# EAGLE board CosmicPiuTelescopeAlpha (EAGLE 8.3.1), part 1 of 2
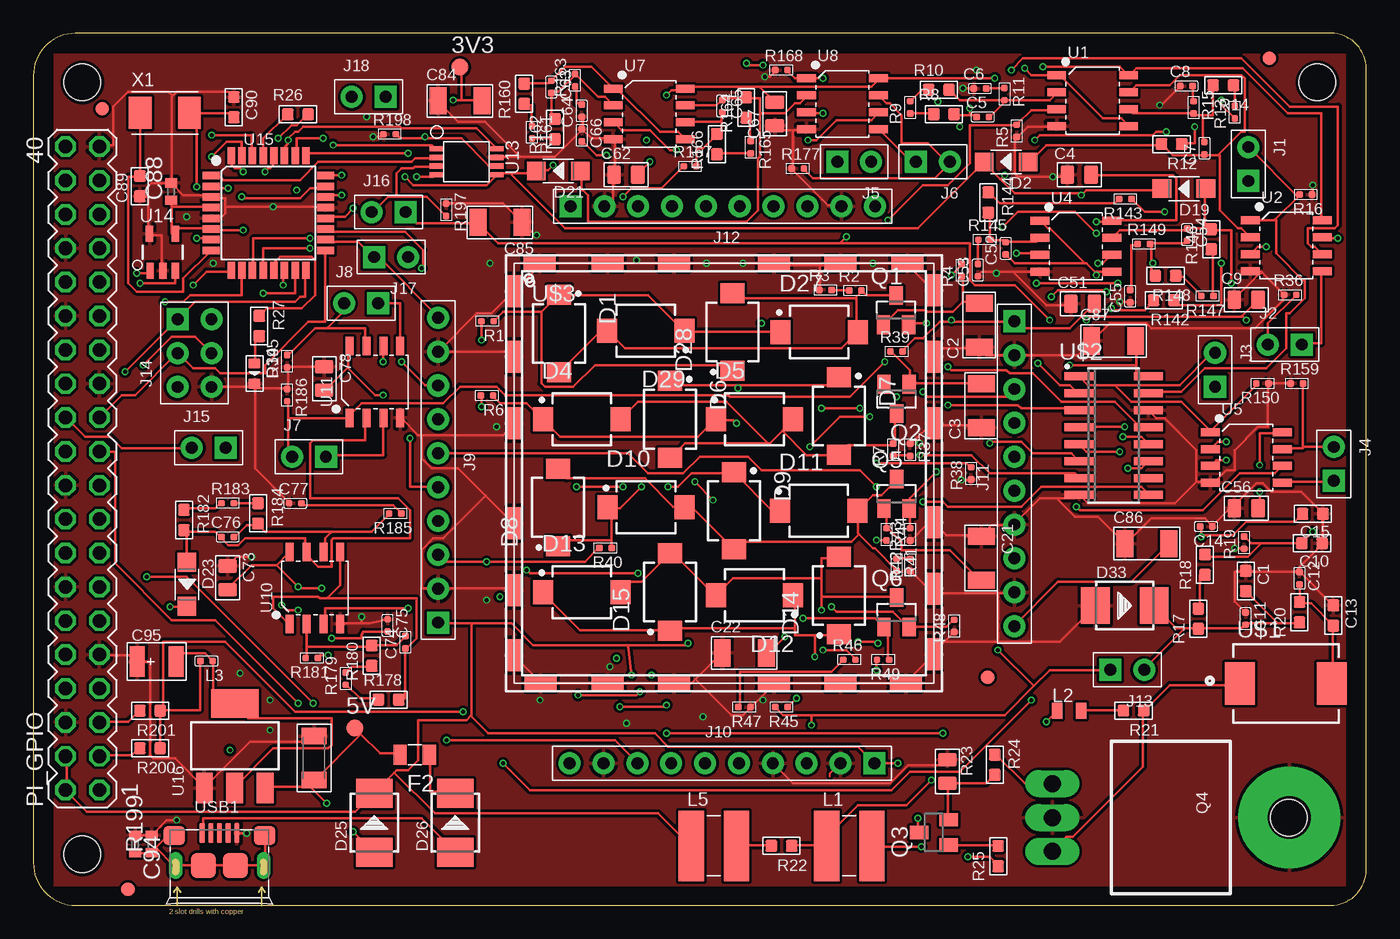
[diagram p2: board, top side]
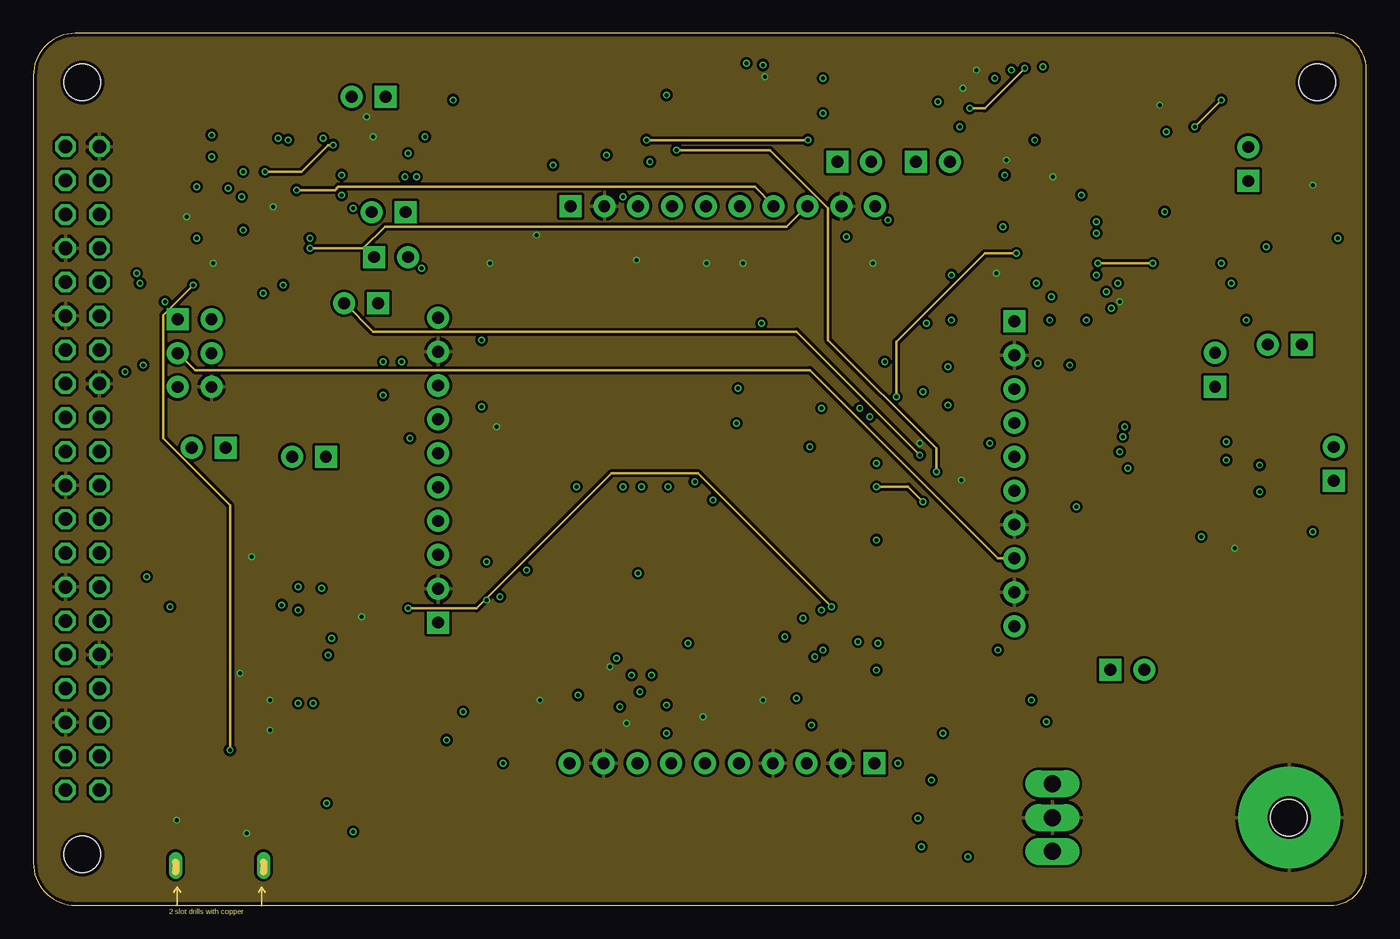
[diagram p3: board, inner layer Route2]
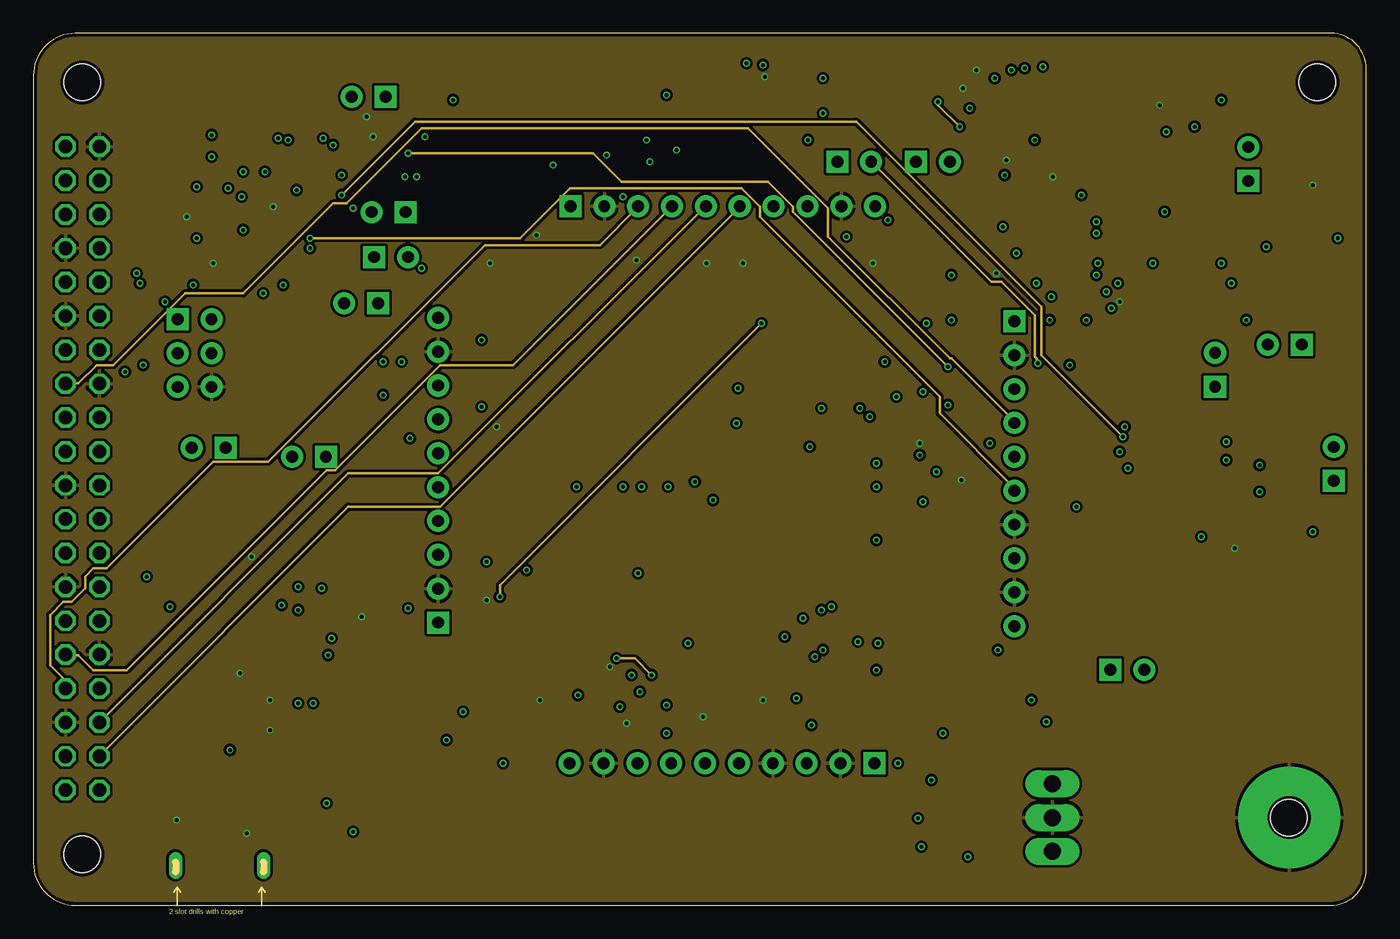
[diagram p4: board, inner layer Route15]
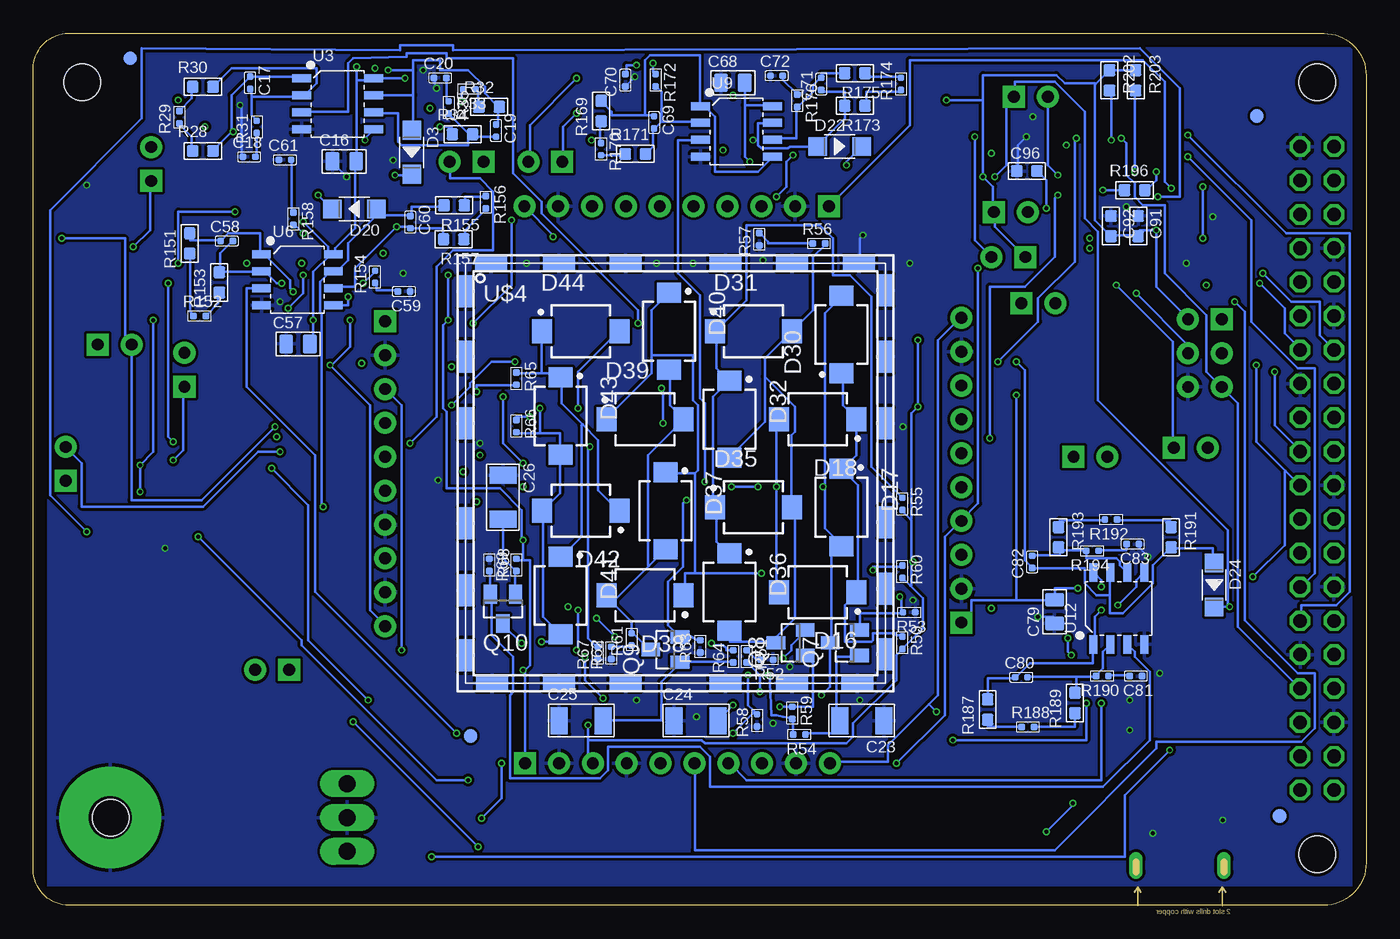
[diagram p5: board, bottom side, seen from below]

Size 100 x 65.39 mm. Coordinates in mm from the lower left corner, seen from the top.
Outline: 3.17,0 97.33,0 arc90 100,2.67 100,62.75 arc90 97.35,65.39 3.15,65.39 arc90 0,62.24 0,3.18 arc90 3.17,0
Copper layers (1*2*15*16): Top 0.035mm / dielectric 0.2mm / Route2 0.0175mm / dielectric 0.3mm / Route15 0.0175mm / dielectric 0.2mm / Bottom 0.035mm
Design rules "SeeedStudio_4layer_DRU_no_angle_20140221": minimum track width 8mil, minimum drill 12mil, track to track 8mil, track to pad 8mil, pad to pad 8mil, via to via 8mil, smd to smd 0mil, copper to edge 10mil, drill to drill 8mil, minimum pad ring 6mil, minimum via ring 4mil, stop-mask expansion 4mil, vias tented up to drill 25mil, thermal gap 10mil
Net classes: 0 default: width 0.152 mm, clearance 0.152 mm; 1 Power: width 0.152 mm, clearance 0.152 mm; 2 hv: width 0.152 mm, clearance 0.152 mm; 3 PowerGND: width 0.152 mm, clearance 0.152 mm
Holes 2.75 mm at 3.68,61.72 3.68,3.81 94.21,6.55 96.34,61.72
tRestrict: area 0,63.9 to 100.5,66.9; area 98.5,-1.1 to 101.5,65.4; area -3,-2.1 to 99.5,1.4; area -4,-2.1 to 1.5,66.4
bRestrict: area -0.5,64.4 to 100.5,67.4; area 99,-1.6 to 103,66.4; area -2,-2.6 to 102.5,1.4; area -2.5,0.4 to 1,66.4

## Footprints (pad centres in the part's own frame; a part is rotated, then mirrored left to right if it is on the bottom)
B1,27 = smd 1.27 x 1.27: TP 0,0
C0603 = smd 0.889 x 0.889: 1 0,0.762; 2 0,-0.762
C1206 = smd 1.27 x 2.032: 1 -1.651,0; 2 1.651,0
C0805 = smd 1.397 x 1.016: 1 0,0.889; 2 0,-0.889
C0402 = smd 0.5 x 0.5: 1 0,0.463; 2 0,-0.463
C0402' = smd 0.7 x 0.9: 1 -0.65,0; 2 0.65,0
1206 = smd 1.219 x 1.88: 1 -1.651,0; 2 1.651,0
AVX-B = smd 1.143 x 2.286: + -1.46,0; - 1.46,0
SOD6439X130N = smd 1.5 x 1.8: A 2.9,0; C -2.9,0
SOD-123 = smd 1.397 x 1.397: + -1.651,0; - 1.651,0
DO-214AA = smd 2.159 x 2.743: + -2.21,0; - 2.21,0
LED-0603 = smd 0.762 x 0.889: + -0.762,0; - 0.762,0
F0805 = smd 1 x 1.5: P$1 -1.1,0; P$2 1.1,0
FIDUCIAL-1X2 = smd 1 x 1: 1 0,0
H2-2.54 = drill 0.889 pad 1.651 square: 1 0,1.27 | drill 0.889 pad 1.651: 2 0,-1.27
H10-2.54 = drill 0.889 pad 1.651 square: 1 0,11.43 | drill 0.889 pad 1.651: 2 0,8.89; 3 0,6.35; 4 0,3.81; 5 0,1.27; 6 0,-1.27; 7 0,-3.81; 8 0,-6.35; 9 0,-8.89; 10 0,-11.43
H2X3-2.54 = drill 0.889 pad 1.651 square: 1 -1.27,2.54 | drill 0.889 pad 1.651: 2 -1.27,0; 3 -1.27,-2.54; 4 1.27,-2.54; 5 1.27,0; 6 1.27,2.54
L2018 = smd 1.9 x 5.3: P$1 -1.7,0; P$2 1.7,0
L0805 = smd 0.8 x 1.2: P$1 -0.9,0; P$2 0.9,0
L0402 = smd 0.5 x 0.5: 1 -0.463,0; 2 0.463,0
MA20-2 = drill 1.016 octagon: 1 -24.13,-1.27; 2 -24.13,1.27; 3 -21.59,-1.27; 4 -21.59,1.27; 5 -19.05,-1.27; 6 -19.05,1.27; 7 -16.51,-1.27; 8 -16.51,1.27; 9 -13.97,-1.27; 10 -13.97,1.27; 11 -11.43,-1.27; 12 -11.43,1.27; 13 -8.89,-1.27; 14 -8.89,1.27; 15 -6.35,-1.27; 16 -6.35,1.27; 17 -3.81,-1.27; 18 -3.81,1.27; 19 -1.27,-1.27; 20 -1.27,1.27; 21 1.27,-1.27; 22 1.27,1.27; 23 3.81,-1.27; 24 3.81,1.27; 25 6.35,-1.27; 26 6.35,1.27; 27 8.89,-1.27; 28 8.89,1.27; 29 11.43,-1.27; 30 11.43,1.27; 31 13.97,-1.27; 32 13.97,1.27; 33 16.51,-1.27; 34 16.51,1.27; 35 19.05,-1.27; 36 19.05,1.27; 37 21.59,-1.27; 38 21.59,1.27; 39 24.13,-1.27; 40 24.13,1.27
SOT23 = smd 1 x 1.4: 1 -0.95,-1.1; 2 0.95,-1.1; 3 0,1.1
TO-220 = drill 1.27 pad 2.032 long: 1 -2.54,-11.43; 2 0,-11.43; 3 2.54,-11.43 | drill 3.2 pad 7.62: HEAT 0,6.35
R0402 = smd 0.5 x 0.5: 1 0,0.463; 2 0,-0.463
R0603 = smd 0.889 x 0.889: 1 0,0.762; 2 0,-0.762
R0805 = smd 1.397 x 1.016: 1 0,0.889; 2 0,-0.889
R0402' = smd 0.7 x 0.9: 1 -0.65,0; 2 0.65,0
SOIC8-1.27-5X4MM = smd 0.6 x 1.4: 1 -1.905,-2.7; 2 -0.635,-2.7; 3 0.635,-2.7; 4 1.905,-2.7; 5 1.905,2.7; 6 0.635,2.7; 7 -0.635,2.7; 8 -1.905,2.7
VSSOP8 = smd 0.4 x 1: P$1 -0.975,-2.275; P$2 -0.325,-2.275; P$3 0.325,-2.275; P$4 0.975,-2.275; P$5 0.975,2.275; P$6 0.325,2.275; P$7 -0.325,2.275; P$8 -0.975,2.275
SOT235 = smd 0.55 x 1.2: 1 -0.95,-1.4; 2 0,-1.4; 3 0.95,-1.4; 4 0.95,1.4; 5 -1,1.4
TQFP32-0.8-7X7MM = smd 1.27 x 0.559: 1 -4.293,2.8; 2 -4.293,2; 3 -4.293,1.2; 4 -4.293,0.4; 5 -4.293,-0.4; 6 -4.293,-1.2; 7 -4.293,-2; 8 -4.293,-2.8; 17 4.293,-2.8; 18 4.293,-2; 19 4.293,-1.2; 20 4.293,-0.4; 21 4.293,0.4; 22 4.293,1.2; 23 4.293,2; 24 4.293,2.8 | smd 0.559 x 1.27: 9 -2.8,-4.293; 10 -2,-4.293; 11 -1.2,-4.293; 12 -0.4,-4.293; 13 0.4,-4.293; 14 1.2,-4.293; 15 2,-4.293; 16 2.8,-4.293; 25 2.8,4.293; 26 2,4.293; 27 1.2,4.293; 28 0.4,4.293; 29 -0.4,4.293; 30 -1.2,4.293; 31 -2,4.293; 32 -2.8,4.293
SOT-223 = smd 1.27 x 2.286: 1 -2.286,-3.175; 2 0,-3.175; 3 2.286,-3.175 | smd 3.556 x 2.159: TER 0,3.175
DIOM8059X265N = smd 2.25 x 3.2: 1 -3.45,0; 2 3.45,0
SOIC127P600X175-16N = smd 2.2 x 0.6: 1 -2.6,4.445; 2 -2.6,3.175; 3 -2.6,1.905; 4 -2.6,0.635; 5 -2.6,-0.635; 6 -2.6,-1.905; 7 -2.6,-3.175; 8 -2.6,-4.445; 9 2.6,-4.445; 10 2.6,-3.175; 11 2.6,-1.905; 12 2.6,-0.635; 13 2.6,0.635; 14 2.6,1.905; 15 2.6,3.175; 16 2.6,4.445
36103305 = smd 1 x 2.4: P$1 0,-7; P$2 0,-12; P$3 0,-19.5; P$4 0,-24.5; P$5 0,-29.4; P$12 31.5,-29.3; P$13 31.5,-24.4; P$14 31.5,-19.4; P$15 31.5,-12; P$16 31.5,-7; P$17 31.5,-2; P$24 0,-2.1 | smd 2.4 x 1: P$6 2,-31.5; P$7 7,-31.5; P$8 12,-31.5; P$9 19.5,-31.5; P$10 24.5,-31.5; P$11 29.4,-31.5; P$18 29.5,0; P$19 24.5,0; P$20 19.5,0; P$21 12,0; P$22 7,0; P$23 1.9,0
MICRO-USB5+6P-SMD-0.65-B = smd 0.4 x 1.5: 1 -1.3,-0.25; 2 -0.65,-0.25; 3 0,-0.25; 4 0.65,-0.25; 5 1.3,-0.25 | smd 1.6 x 1.4: S1 -3.4,-0.427; S6 3.4,-0.427 | drill 0.508 pad 1.016 long: S2 -3.3,-2.675; S5 3.3,-2.675 | smd 1.9 x 1.9: S3 -1.2,-2.675; S4 1.2,-2.675
X5032_2P = smd 1.7 x 2.4: P$1 -1.85,0; P$2 1.85,0

## Placement (x,y rotation side)
3V3  TPB1,27  [B1,27]  32,62.86 0 top
5V  TPB1,27  [B1,27]  24.11,13.3 0 top
C1  100nf  [C0603]  90.96,24.32 0 top
C2  22uf  [C1206]  70.97,43.51 90 top
C3  22uf  [C1206]  71.12,37.47 90 top
C4  22uf  [C0805]  78.48,54.78 90 top
C5  47PF  [C0402]  71.23,59.12 90 top
C6  100nf  [C0402]  71.02,61.25 90 top
C7  47PF  [C0402]  87.86,56.78 180 top
C8  100nf  [C0402]  86.51,61.44 90 top
C9  22uf  [C0805]  91,45.42 90 top
C10  1nf  [C0603]  95.93,27.14 270 top
C11  47PF  [C0402]  90.96,21.5 0 top
C12  47nf  [C0402]  95,24.53 0 top
C13  100nf  [C0603]  97.54,21.72 0 top
C14  47nf  [C0402]  87.99,28.41 270 top
C15  100nf  [C0603]  95.99,29.35 270 top
C16  22uf  [C0805]  76.67,55.79 90 bottom
C17  47PF  [C0402]  83.74,61.69 0 bottom
C18  100nf  [C0402]  83.81,56.13 90 bottom
C19  47PF  [C0402]  65.29,58.1 0 bottom
C20  100nf  [C0402]  69.48,62.05 90 bottom
C21  22uf  [C1206]  71.12,26.04 270 top
C22  22uf  [C1206]  53.34,18.92 0 top
C23  22uf  [C1206]  37.85,13.85 180 bottom
C24  22uf  [C1206]  50.28,13.85 0 bottom
C25  22uf  [C1206]  58.9,13.85 0 bottom
C26  22uf  [C1206]  64.77,30.61 270 bottom
C51  22uf  [C0805]  78.72,45.12 90 top
C52  47PF  [C0402]  72.95,49.27 180 top
C53  100nf  [C0402]  70.87,47.64 180 top
C54  47PF  [C0402]  86.57,50.3 0 top
C55  100nf  [C0402]  82.3,45.68 180 top
C56  22uf  [C0805]  91,29.78 90 top
C57  22uf  [C0805]  80.14,42.1 90 bottom
C58  47PF  [C0402]  85.48,49.81 90 bottom
C59  100nf  [C0402]  72.2,46.04 270 bottom
C60  47PF  [C0402]  71.72,51.24 0 bottom
C61  100nf  [C0402]  81.12,55.91 90 bottom
C62  22uf  [C0805]  44.47,54.79 90 top
C63  47PF  [C0402]  38.86,61.37 0 top
C64  100nf  [C0402]  41.14,59.59 180 top
C65  47PF  [C0402]  51.69,59.94 0 top
C66  100nf  [C0402]  41.15,57.75 0 top
C67  22uf  [C0805]  55.63,59.35 180 top
C68  22uf  [C0805]  47.51,61.69 90 bottom
C69  47PF  [C0402]  53.43,58.72 0 bottom
C70  100nf  [C0402]  55.59,61.88 180 bottom
C71  47PF  [C0402]  40.88,61.6 180 bottom
C72  100nf  [C0402]  44.23,62.21 90 bottom
C73  22uf  [C0805]  14.57,24.56 0 top
C74  47PF  [C0402]  27.92,19.72 180 top
C75  100nf  [C0402]  26.58,20.99 0 top
C76  47PF  [C0402]  14.58,27.63 90 top
C77  100nf  [C0402]  19.65,30.15 90 top
C78  22uf  [C0805]  21.83,39.5 0 top
C79  22uf  [C0805]  23.38,22.03 180 bottom
C80  47PF  [C0402]  25.88,17.1 90 bottom
C81  100nf  [C0402]  17.28,17.19 270 bottom
C82  47PF  [C0402]  25.06,25.75 180 bottom
C83  100nf  [C0402]  17.52,27.08 270 bottom
C84  100nf  [C1206]  32,60.33 0 top
C85  100nf  [C1206]  35,51.22 180 top
C86  100nf  [C1206]  83.55,27.11 0 top
C87  100nf  [C1206]  81.05,42.32 0 top
C88  [C0402']  10.34,53.53 90 top
C89  22pf  [C0603]  7.99,53.93 180 top
C90  22pf  [C0603]  15.05,59.86 0 top
C91  22pf  [C0603]  17.11,50.94 0 bottom
C92  22pf  [C0603]  19.14,50.94 0 bottom
C93  47uF  [1206]  21.06,11.04 90 top
C94  [C0402']  7.63,4.59 270 top
C95  22uf  [AVX-B]  9.25,18.28 0 top
C96  100n  [C0603]  25.46,55.07 90 bottom
D1  VBPW34FAS  [SOD6439X130N]  39.45,42.89 270 top
D2  MMSD4148-sod123  [SOD-123]  72.98,55.75 180 top
D3  MMSD4148-sod123  [SOD-123]  71.61,56.47 270 bottom
D4  VBPW34FAS  [SOD6439X130N]  41.15,36.45 0 top
D5  VBPW34FAS  [SOD6439X130N]  54.1,36.45 0 top
D6  VBPW34FAS  [SOD6439X130N]  47.75,36.45 270 top
D7  VBPW34FAS  [SOD6439X130N]  60.45,36.7 270 top
D8  VBPW34FAS  [SOD6439X130N]  39.37,29.85 90 top
D9  VBPW34FAS  [SOD6439X130N]  52.58,29.59 270 top
D10  VBPW34FAS  [SOD6439X130N]  45.97,29.85 0 top
D11  VBPW34FAS  [SOD6439X130N]  58.93,29.59 0 top
D12  VBPW34FAS  [SOD6439X130N]  54.1,23.24 180 top
D13  VBPW34FAS  [SOD6439X130N]  41.15,23.5 0 top
D14  VBPW34FAS  [SOD6439X130N]  60.45,23.24 90 top
D15  VBPW34FAS  [SOD6439X130N]  47.75,23.5 90 top
D16  VBPW34FAS  [SOD6439X130N]  41.15,23.5 180 bottom
D17  VBPW34FAS  [SOD6439X130N]  39.37,29.85 270 bottom
D18  VBPW34FAS  [SOD6439X130N]  41.15,36.45 180 bottom
D19  MMSD4148-sod123  [SOD-123]  86.32,53.74 180 top
D20  MMSD4148-sod123  [SOD-123]  75.92,52.22 180 bottom
D21  MMSD4148-sod123  [SOD-123]  39.4,55.08 180 top
D22  MMSD4148-sod123  [SOD-123]  39.51,56.91 0 bottom
D23  MMSD4148-sod123  [SOD-123]  11.53,24.07 270 top
D24  MMSD4148-sod123  [SOD-123]  11.41,24.02 270 bottom
D25  28V-5A  [DO-214AA]  25.57,6.19 90 top
D26  28V-5A  [DO-214AA]  31.65,6.19 90 top
D27  VBPW34FAS  [SOD6439X130N]  58.95,43 0 top
D28  VBPW34FAS  [SOD6439X130N]  52.45,43 90 top
D29  VBPW34FAS  [SOD6439X130N]  45.95,43.1 180 top
D30  VBPW34FAS  [SOD6439X130N]  39.37,42.8 90 bottom
D31  VBPW34FAS  [SOD6439X130N]  45.97,43.05 0 bottom
D32  VBPW34FAS  [SOD6439X130N]  47.75,36.45 270 bottom
D33  28V-5A  [DO-214AA]  81.88,22.48 0 top
D34  BLUE-0603  [LED-0603]  16.59,39.87 270 top
D35  VBPW34FAS  [SOD6439X130N]  45.97,29.85 0 bottom
D36  VBPW34FAS  [SOD6439X130N]  47.75,23.5 270 bottom
D37  VBPW34FAS  [SOD6439X130N]  52.58,29.59 270 bottom
D38  VBPW34FAS  [SOD6439X130N]  54.1,23.24 180 bottom
D39  VBPW34FAS  [SOD6439X130N]  54.1,36.45 0 bottom
D40  VBPW34FAS  [SOD6439X130N]  52.32,43.05 270 bottom
D41  VBPW34FAS  [SOD6439X130N]  60.45,23.24 270 bottom
D42  VBPW34FAS  [SOD6439X130N]  58.93,29.59 180 bottom
D43  VBPW34FAS  [SOD6439X130N]  60.45,36.7 270 bottom
D44  VBPW34FAS  [SOD6439X130N]  58.93,43.05 0 bottom
F2  307010159_SMD_PPTC_6V_0805  [F0805]  28.61,11.27 180 top
FD1  FIDUCIAL1X2  [FIDUCIAL-1X2]  5.15,59.72 0 top
FD2  FIDUCIAL1X2  [FIDUCIAL-1X2]  7.1,1.2 0 top
FD3  FIDUCIAL1X2  [FIDUCIAL-1X2]  92.71,63.53 0 top
FD4  FIDUCIAL1X2  [FIDUCIAL-1X2]  71.6,17.09 0 top
FD5  FIDUCIAL1X2  [FIDUCIAL-1X2]  8.2,59.19 0 bottom
FD6  FIDUCIAL1X2  [FIDUCIAL-1X2]  6.5,6.7 0 bottom
FD7  FIDUCIAL1X2  [FIDUCIAL-1X2]  92.71,63.53 0 bottom
FD8  FIDUCIAL1X2  [FIDUCIAL-1X2]  67.2,12.7 0 bottom
J1  2p-2.54  [H2-2.54]  91.16,55.59 180 top
J2  2p-2.54  [H2-2.54]  93.89,42.06 270 top
J3  2p-2.54  [H2-2.54]  88.66,40.17 180 top
J4  2p-2.54  [H2-2.54]  97.58,33.11 180 top
J5  2p-2.54  [H2-2.54]  61.59,55.76 90 top
J6  2p-2.54  [H2-2.54]  67.49,55.76 90 top
J7  2p-2.54  [H2-2.54]  20.68,33.65 270 top
J8  2p-2.54  [H2-2.54]  24.59,45.15 270 top
J9  10p-2.54  [H10-2.54]  30.38,32.63 180 top
J10  10p-2.54  [H10-2.54]  51.67,10.66 270 top
J11  10p-2.54  [H10-2.54]  73.61,32.36 0 top
J12  10p-2.54  [H10-2.54]  51.73,52.44 90 top
J13  2p-2.54  [H2-2.54]  82.08,17.66 90 top
J14  YELLOW-2X3P-2.54  [H2X3-2.54]  12.09,41.41 0 top
J15  2p-2.54  [H2-2.54]  13.15,34.31 270 top
J16  2P-2.54  [H2-2.54]  26.65,51.99 270 top
J17  2P-2.54  [H2-2.54]  26.85,48.62 90 top
J18  2p-2.54  [H2-2.54]  25.15,60.63 270 top
L1  303010169_330UH_5X5MM  [L2018]  61.21,4.45 0 top
L2  303010098_100UH_0805  [L0805]  77.72,14.61 0 top
L3  4.7NH-300MA  [L0402]  12.99,18.32 180 top
L5  303010169_330UH_5X5MM  [L2018]  51.05,4.45 0 top
LOGO1  OSHW-LOGOL  [OSHW-LOGO-L]  -5.25,-35.11 0 top  (outside the outline)
PI_GPIO  [MA20-2]  3.68,32.77 90 top
Q1  SST5484  [SOT23]  64.73,44.64 0 top
Q2  SST5484  [SOT23]  64.77,37.97 180 top
Q3  2N7002,215  [SOT23]  67.56,5.47 90 top
Q4  IRF520NPBF  [TO-220]  87.88,6.58 270 top
Q5  SST5484  [SOT23]  64.77,30.86 0 top
Q6  SST5484  [SOT23]  64.77,21.97 0 top
Q7  SST5484  [SOT23]  39.12,19.68 90 bottom
Q8  SST5484  [SOT23]  43.18,19.68 90 bottom
Q9  SST5484  [SOT23]  52.58,19.18 90 bottom
Q10  SST5484  [SOT23]  64.77,22.22 180 bottom
R1  1M  [R0402]  34.07,43.81 270 top
R2  10M 1/16W  [R0402]  61.67,46.1 90 top
R3  10M 1/16W  [R0402]  59.43,46.15 90 top
R4  1k  [R0402]  69.65,47.62 180 top
R5  4.7K  [R0402]  73.79,58.08 180 top
R6  1M  [R0402]  34.04,38.23 270 top
R7  10M 1/16W  [R0402]  64.52,34.16 180 top
R8  200K  [R0603]  68.32,59.33 270 top
R9  100K  [R0402]  65.78,59.84 180 top
R10  30K  [R0603]  67.94,61.16 270 top
R11  10K 1/16W  [R0402]  72.86,60.84 0 top
R12  200K  [R0603]  85.4,57.09 90 top
R13  100K  [R0402]  90.14,59.47 180 top
R14  30K  [R0603]  89.28,61.5 90 top
R15  10K 1/16W  [R0402]  87.05,59.84 0 top
R16  49.9R  [R0402]  95.46,53.3 270 top
R17  200K  [R0603]  87.41,21.49 0 top
R18  20K  [R0603]  87.91,25.54 0 top
R19  2.7K 1/16W  [R0402]  90.85,27.2 180 top
R20  1K  [R0603]  95,21.98 0 top
R21  3.6R 1/10W  [R0603]  82.55,14.61 90 top
R22  3.6R 1/10W  [R0603]  56.13,4.45 90 top
R23  4.7K  [R0805]  68.58,10.03 0 top
R24  10R  [R0603]  72.14,10.54 180 top
R25  10R  [R0603]  72.39,3.68 0 top
R26  10K  [R0603]  19.86,59.31 270 top
R27  10K  [R0603]  16.95,43.44 180 top
R28  200K  [R0603]  87.28,56.57 270 bottom
R29  100K  [R0402]  89.04,59.1 180 bottom
R30  30K  [R0603]  87.28,61.38 270 bottom
R31  10K 1/16W  [R0402]  83.24,58.37 180 bottom
R32  200K  [R0603]  65.8,59.88 270 bottom
R33  100K  [R0402]  67.29,61.2 270 bottom
R34  30K  [R0603]  67.8,57.83 270 bottom
R35  10K 1/16W  [R0402]  68.84,59.83 0 bottom
R36  49.9R  [R0402]  94.29,45.78 90 top
R37  10M 1/16W  [R0402]  65.79,34.16 0 top
R38  4.7K  [R0402]  70.36,32.39 180 top
R39  1k  [R0402]  64.77,41.53 90 top
R40  1M  [R0402]  42.93,26.8 270 top
R41  10M 1/16W  [R0402]  64.77,25.53 0 top
R42  10M 1/16W  [R0402]  65.79,25.53 180 top
R43  4.7K  [R0402]  65.79,27.81 180 top
R44  1k  [R0402]  64.01,27.81 0 top
R45  1M  [R0402]  56.13,14.86 270 top
R46  10M 1/16W  [R0402]  61.21,18.42 90 top
R47  10M 1/16W  [R0402]  53.34,14.86 270 top
R48  4.7K  [R0402]  69.09,20.96 180 top
R49  1k  [R0402]  63.75,18.42 270 top
R50  1M  [R0402]  34.8,19.68 0 bottom
R51  10M 1/16W  [R0402]  46.48,18.67 0 bottom
R52  10M 1/16W  [R0402]  44.96,18.42 270 bottom
R53  4.7K  [R0402]  34.29,21.97 270 bottom
R54  1k  [R0402]  42.54,12.8 270 bottom
R55  1M  [R0402]  34.8,30.1 0 bottom
R56  10M 1/16W  [R0402]  41.06,49.63 90 bottom
R57  10M 1/16W  [R0402]  45.53,49.95 180 bottom
R58  4.7K  [R0402]  45.7,13.86 180 bottom
R59  1k  [R0402]  43.07,14.43 0 bottom
R60  1M  [R0402]  34.8,25.02 0 bottom
R61  10M 1/16W  [R0402]  55.12,19.94 180 bottom
R62  10M 1/16W  [R0402]  56.64,18.92 180 bottom
R63  4.7K  [R0402]  49.97,19.42 180 bottom
R64  1k  [R0402]  47.5,18.67 180 bottom
R65  1M  [R0402]  63.75,39.5 0 bottom
R66  10M 1/16W  [R0402]  63.75,35.94 0 bottom
R67  10M 1/16W  [R0402]  57.66,18.92 180 bottom
R68  4.7K  [R0402]  65.79,25.53 0 bottom
R69  1k  [R0402]  63.75,25.53 180 bottom
R142  200K  [R0603]  84.81,45.38 90 top
R143  100K  [R0402]  81.93,52.97 270 top
R144  30K  [R0603]  71.65,52.7 180 top
R145  10K 1/16W  [R0402]  71.37,49.92 90 top
R146  200K  [R0603]  88.38,49.95 0 top
R147  100K  [R0402]  88.1,45.69 270 top
R148  30K  [R0603]  84.94,47.22 90 top
R149  10K 1/16W  [R0402]  83.32,49.6 90 top
R150  49.9R  [R0402]  92.22,39.14 270 top
R151  200K  [R0603]  88.27,49.64 0 bottom
R152  100K  [R0402]  87.52,44.2 90 bottom
R153  30K  [R0603]  86.05,46.71 0 bottom
R154  10K 1/16W  [R0402]  74.36,47.12 180 bottom
R155  200K  [R0603]  68.43,52.49 90 bottom
R156  100K  [R0402]  66.06,52.73 0 bottom
R157  30K  [R0603]  68.46,49.95 90 bottom
R158  10K 1/16W  [R0402]  80.49,51.48 0 bottom
R159  49.9R  [R0402]  94.79,39.14 90 top
R160  200K  [R0603]  36.83,60.86 0 top
R161  100K  [R0402]  37.42,57.97 0 top
R162  30K  [R0603]  39.14,58.21 0 top
R163  10K 1/16W  [R0402]  40.64,61.87 180 top
R164  200K  [R0603]  53.49,59.83 0 top
R165  100K  [R0402]  53.83,56.85 0 top
R166  30K  [R0603]  51.28,57.08 0 top
R167  10K 1/16W  [R0402]  49.27,55.42 90 top
R168  49.9R  [R0402]  56.12,62.63 90 top
R169  200K  [R0603]  57.4,59.56 0 bottom
R170  100K  [R0402]  57.41,56.72 0 bottom
R171  30K  [R0603]  54.83,56.35 270 bottom
R172  10K 1/16W  [R0402]  53.32,61.88 0 bottom
R173  200K  [R0603]  38.36,59.96 90 bottom
R174  100K  [R0402]  34.9,61.6 180 bottom
R175  30K  [R0603]  38.36,62.41 90 bottom
R176  10K 1/16W  [R0402]  42.68,60.34 0 bottom
R177  49.9R  [R0402]  57.36,55.25 90 top
R178  200K  [R0603]  26.65,15.42 270 top
R179  100K  [R0402]  23.43,17 180 top
R180  30K  [R0603]  25.39,18.72 0 top
R181  10K 1/16W  [R0402]  20.89,18.56 270 top
R182  200K  [R0603]  11.3,28.89 180 top
R183  100K  [R0402]  14.58,30.15 90 top
R184  30K  [R0603]  16.86,29.39 180 top
R185  10K 1/16W  [R0402]  27.15,29.38 270 top
R186  49.9R  [R0402]  19.04,38.26 0 top
R187  200K  [R0603]  28.4,14.68 0 bottom
R188  100K  [R0402]  25.38,13.38 90 bottom
R189  30K  [R0603]  21.84,15.18 0 bottom
R190  10K 1/16W  [R0402]  19.81,17.19 270 bottom
R191  200K  [R0603]  14.64,27.6 180 bottom
R192  100K  [R0402]  19.14,28.93 270 bottom
R193  30K  [R0603]  23.08,27.6 180 bottom
R194  10K 1/16W  [R0402]  20.55,26.58 270 bottom
R195  49.9R  [R0402]  19.04,40.8 180 top
R196  10  [R0603]  17.37,53.63 270 bottom
R197  10k  [R0402]  30.97,52.16 0 top
R198  10k  [R0402]  26.73,57.83 90 top
R199  1M  [R0402']  8.86,4.59 90 top
R200  4k7  [R0603]  8.76,11.77 90 top
R201  4k7  [R0603]  8.76,14.59 90 top
R202  4k7  [R0603]  19.26,61.87 180 bottom
R203  4k7  [R0603]  17.3,61.87 180 bottom
U1  LM358DR-SOIC8  [SOIC8-1.27-5X4MM]  79.48,60.34 270 top
U2  LM358DR-SOIC8  [SOIC8-1.27-5X4MM]  94,49.47 270 top
U3  LM358DR-SOIC8  [SOIC8-1.27-5X4MM]  77.17,60.1 270 bottom
U4  LM358DR-SOIC8  [SOIC8-1.27-5X4MM]  78.22,49.43 270 top
U5  LM358DR-SOIC8  [SOIC8-1.27-5X4MM]  91,33.58 270 top
U6  LM358DR-SOIC8  [SOIC8-1.27-5X4MM]  80.18,46.91 270 bottom
U7  LM358DR-SOIC8  [SOIC8-1.27-5X4MM]  46.21,59.35 270 top
U8  LM358DR-SOIC8  [SOIC8-1.27-5X4MM]  60.71,60.1 270 top
U9  LM358DR-SOIC8  [SOIC8-1.27-5X4MM]  47.24,58.04 270 bottom
U10  LM358DR-SOIC8  [SOIC8-1.27-5X4MM]  21.13,23.8 0 top
U11  LM358DR-SOIC8  [SOIC8-1.27-5X4MM]  25.63,39.25 0 top
U12  LM358DR-SOIC8  [SOIC8-1.27-5X4MM]  18.57,22.26 0 bottom
U13  310990001_ADC121C021CIMM  [VSSOP8]  32.49,55.77 270 top
U14  310090051_24LC32AT-I/OT  [SOT235]  9.71,48.97 0 top
U15  ATMEGA328P-AU-TQFP32  [TQFP32-0.8-7X7MM]  17.65,51.92 0 top
U16  CJT1117-3.3-SOT223  [SOT-223]  15.12,11.96 0 top
U$1  CD214A-F1200  [DIOM8059X265N]  93.98,16.64 0 top
U$2  MC74HC589A  [SOIC127P600X175-16N]  81.05,35.22 0 top
U$3  WURTH36103305  [36103305]  36.07,48.13 0 top
U$4  WURTH36103305  [36103305]  67.56,48.13 0 bottom
USB1  10118193-0001LF  [MICRO-USB5+6P-SMD-0.65-B]  13.97,5.66 0 top
X1  306010054_XTAL_16MHZ-5032_2P  [X5032_2P]  9.86,59.42 0 top